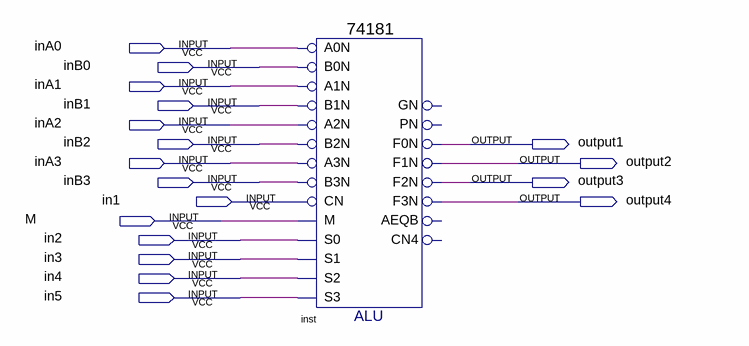
[diagram p0: schematic sheet]
// Quartus schematic EE243Lab4.bdf as structural Verilog: 1 symbols, 18 pins
module EE243Lab4 (
  input  inA0,
  input  inB0,
  input  inA1,
  input  inB1,
  input  inA2,
  input  inB2,
  input  inA3,
  input  inB3,
  input  in1,
  input  M,
  input  in2,
  input  in3,
  input  in4,
  input  in5,
  output output1,
  output output2,
  output output3,
  output output4
);

  \74181  inst (
    .B0N(inB0), .A0N(inA0), .A1N(inA1), .B1N(inB1), .A3N(inA3), .B2N(inB2), .A2N(inA2), .M(M), .CN(in1),
    .B3N(inB3), .S2(in4), .S1(in3), .S0(in2), .S3(in5), .F3N(output4), .F1N(output2), .F0N(output1),
    .F2N(output3));  // open: PN, GN, AEQB, CN4
endmodule
